# Altium schematic sheet W5500.SchDoc
size A4
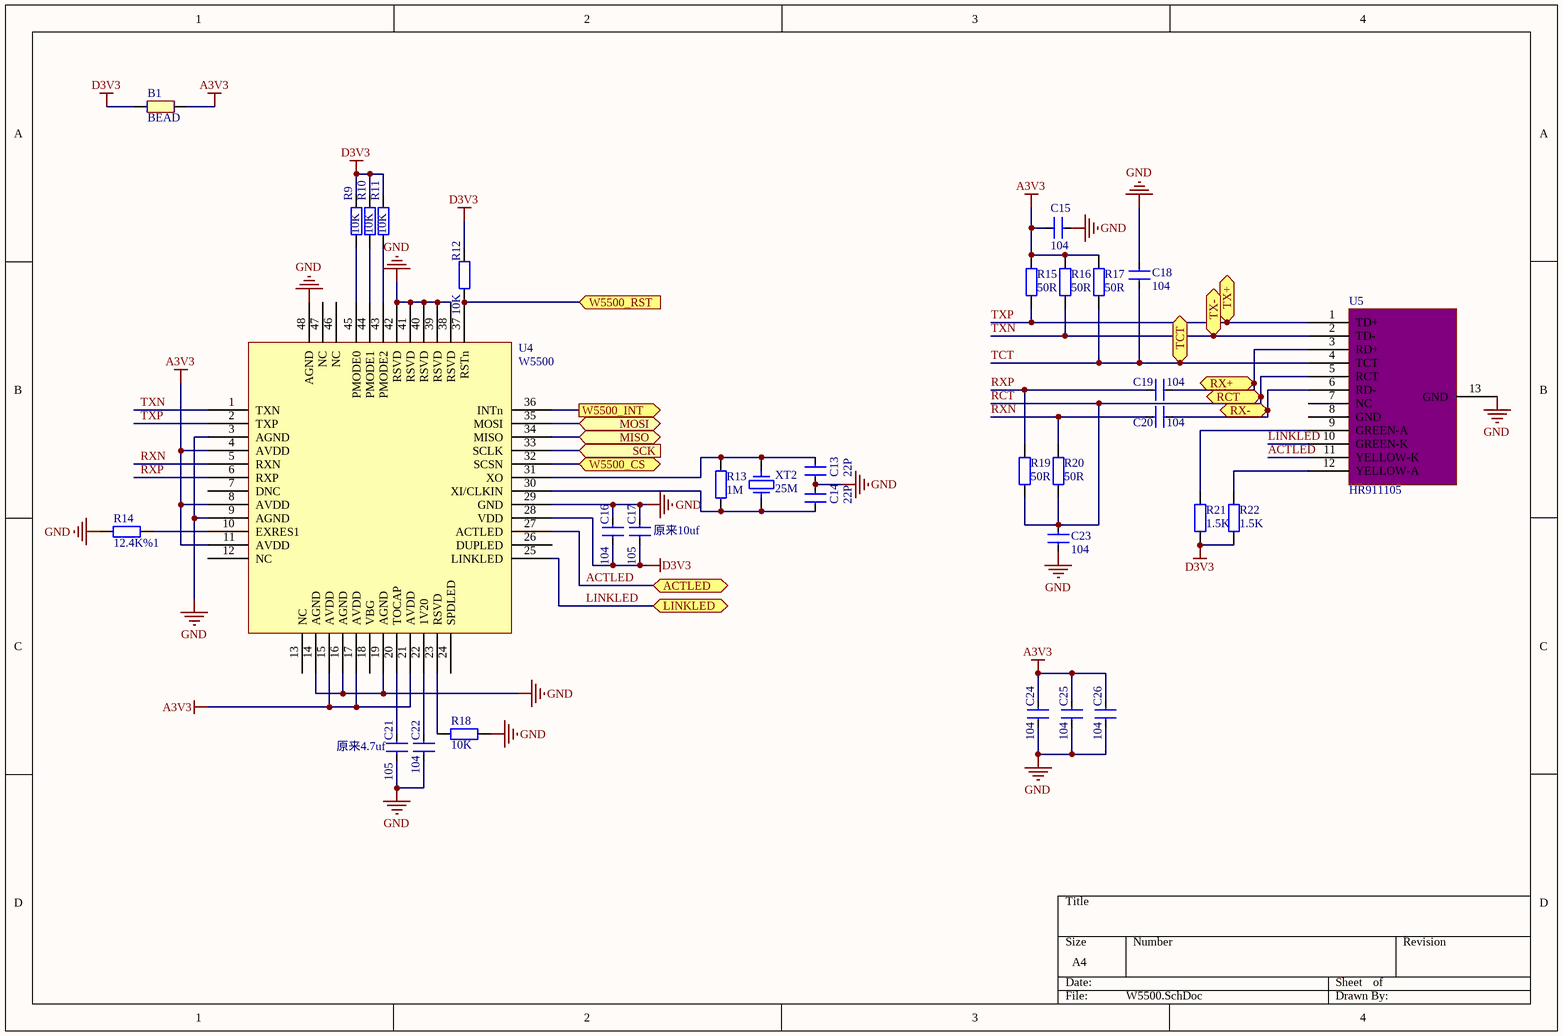
[diagram p0: W5500.SchDoc]

## Parts
B1  BEAD  [0603L]
C13  22P  [0603C]
C14  22P  [0603C]
C15  104  [0603C]
C16  104  [0603C]
C17  105  [0603C]
C18  104  [0603C]
C19  104  [0603C]
C20  104  [0603C]
C21  105  [0603C]
C22  104  [0603C]
C23  104  [0603C]
C24  104  [0603C]
C25  104  [0603C]
C26  104  [0603C]
R9  10K  [0603R]
R10  10K  [0603R]
R11  10K  [0603R]
R12  10K  [0603R]
R13  1M  [0603R]
R14  12.4K%1  [0603R]
R15  50R  [0603R]
R16  50R  [0603R]
R17  50R  [0603R]
R18  10K  [0603R]
R19  50R  [0603R]
R20  50R  [0603R]
R21  1.5K  [0603R]
R22  1.5K  [0603R]
U4  W5500  [LQFP48]
U5  HR911105  [HR911105A]
XT2  25M  [5032]

## Ports
ACTLED, LINKLED, MISO, MOSI, RCT, RX+, RX-, SCK (in), TCT, TX+, TX-, W5500_CS, W5500_INT (out), W5500_RST (in)

## Nets
A3V3: B1.2 C15.1 C24.2 C25.2 C26.2 R15.2 R16.2 R17.2 U4.4(AVDD) U4.8(AVDD) U4.11(AVDD) U4.15(AVDD) U4.17(AVDD) U4.21(AVDD)
D3V3: B1.1 C16.1 C17.1 R9.2 R10.2 R11.2 R12.2 R21.1 R22.1 U4.28(VDD)
GND: C13.1 C14.2 C15.2 C16.2 C17.2 C18.1 C21.1 C22.1 C23.2 C24.1 C25.1 C26.1 R14.2 R18.1 U4.3(AGND) U4.9(AGND) U4.14(AGND) U4.16(AGND) U4.19(AGND) U4.29(GND) U4.38(RSVD) U4.39(RSVD) U4.40(RSVD) U4.41(RSVD) U4.42(RSVD) U4.48(AGND) U5.13(GND)
ACTLED: U4.27(ACTLED) U5.11(YELLOW-K) ; port ACTLED
LINKLED: U4.25(LINKLED) U5.10(GREEN-K) ; port LINKLED
MISO: U4.34(MISO) ; port MISO
MOSI: U4.35(MOSI) ; port MOSI
RCT: C23.1 R19.2 R20.2 U5.5(RCT) ; port RCT
RX+: C19.1 U5.3(RD+) ; port RX+
RX-: C20.1 U5.6(RD-) ; port RX-
RXN: C20.2 R20.1 U4.5(RXN)
RXP: C19.2 R19.1 U4.6(RXP)
SCK: U4.33(SCLK) ; port SCK
TCT: C18.2 R17.1 U5.4(TCT) ; port TCT
TXN: R16.1 U4.1(TXN) U5.2(TD-) ; port TX-
TXP: R15.1 U4.2(TXP) U5.1(TD+) ; port TX+
W5500_CS: U4.32(SCSN) ; port W5500_CS
W5500_INT: U4.36(INTn) ; port W5500_INT
W5500_RST: R12.1 U4.37(RSTn) ; port W5500_RST
NetC13_2: C13.2 R13.2 U4.31(XO) XT2.2
NetC14_1: C14.1 R13.1 U4.30(XI/CLKIN) XT2.1
NetC21_2: C21.2 U4.20(TOCAP)
NetC22_2: C22.2 U4.22(1V20)
NetR9_1: R9.1 U4.45(PMODE0)
NetR10_1: R10.1 U4.44(PMODE1)
NetR11_1: R11.1 U4.43(PMODE2)
NetR14_1: R14.1 U4.10(EXRES1)
NetR18_2: R18.2 U4.23(RSVD)
NetR21_2: R21.2 U5.9(GREEN-A)
NetR22_2: R22.2 U5.12(YELLOW-A)

Not connected (* = marked no-connect by the designer): U4 7(DNC) 12(NC) 13(NC) 18(VBG) 24(SPDLED) 26(DUPLED) 46(NC) 47(NC); U5 7(NC) 8(GND)

## Notes on the sheet
- (near C17) 原来10uf
- (near C21) 原来4.7uf

## Library data of the parts
B1 = BEAD: 磁珠
C13-C26 = CAP: 普通小电容
R9-R22 = RES: 普通电阻
XT2 = XT: 晶振